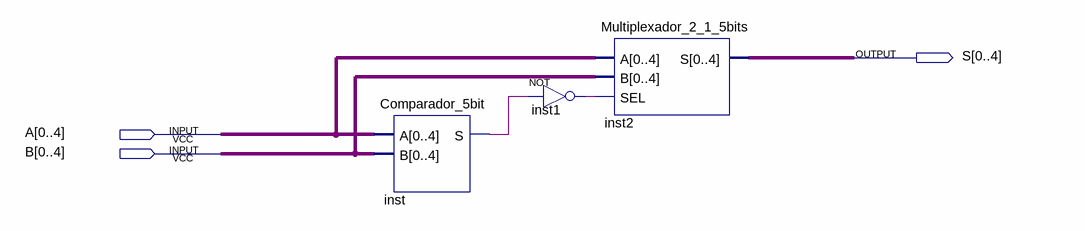
[diagram p0: schematic sheet]
// Quartus schematic Minimo.bdf as structural Verilog: 3 symbols, 3 pins
module Minimo (
  input  [0:4] A,
  input  [0:4] B,
  output [0:4] S
);

  wire inst1_out, inst_s;

  Comparador_5bit inst (.A(A), .B(B), .S(inst_s));
  not inst1 (inst1_out, inst_s);
  Multiplexador_2_1_5bits inst2 (.A(A), .B(B), .SEL(inst1_out), .S(S));
endmodule
